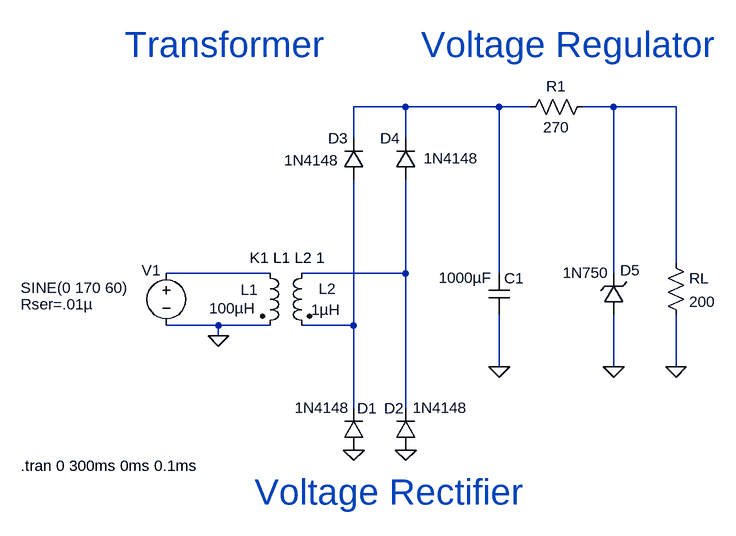
[diagram p0: schematic Midterm02.asc]
Midterm02.asc, the LTspice schematic file:
Version 4
SHEET 1 1308 680
WIRE 384 -96 304 -96
WIRE 528 -96 384 -96
WIRE 576 -96 528 -96
WIRE 704 -96 656 -96
WIRE 800 -96 704 -96
WIRE 304 -48 304 -96
WIRE 384 -48 384 -96
WIRE 800 144 800 -96
WIRE 176 160 16 160
WIRE 384 160 384 16
WIRE 384 160 224 160
WIRE 528 160 528 -96
WIRE 704 160 704 -96
WIRE 96 240 16 240
WIRE 176 240 96 240
WIRE 304 240 304 16
WIRE 304 240 224 240
WIRE 96 256 96 240
WIRE 528 304 528 224
WIRE 704 304 704 224
WIRE 800 304 800 224
WIRE 304 368 304 240
WIRE 384 368 384 160
FLAG 304 432 0
FLAG 384 432 0
FLAG 96 256 0
FLAG 528 304 0
FLAG 704 304 0
FLAG 800 304 0
SYMBOL voltage 16 144 R0
WINDOW 0 -38 11 Left 2
WINDOW 3 -224 38 Left 2
WINDOW 123 0 0 Left 0
WINDOW 39 -224 64 Left 2
SYMATTR InstName V1
SYMATTR Value SINE(0 170 60)
SYMATTR SpiceLine Rser=.01µ
SYMBOL ind2 160 144 R0
WINDOW 0 -30 41 Left 2
WINDOW 3 -78 70 Left 2
SYMATTR InstName L1
SYMATTR Value 100µH
SYMATTR Type ind
SYMBOL ind2 240 144 M0
WINDOW 0 -37 40 Left 2
WINDOW 3 -43 72 Left 2
SYMATTR InstName L2
SYMATTR Value 1µH
SYMATTR Type ind
SYMBOL diode 320 432 R180
WINDOW 3 22 65 Left 2
WINDOW 0 -20 64 Left 2
SYMATTR Value 1N4148
SYMATTR InstName D1
SYMBOL diode 400 432 R180
WINDOW 3 -80 65 Left 2
WINDOW 0 18 64 Left 2
SYMATTR Value 1N4148
SYMATTR InstName D2
SYMBOL diode 320 16 R180
WINDOW 0 24 64 Left 2
WINDOW 3 38 30 Left 2
SYMATTR InstName D3
SYMATTR Value 1N4148
SYMBOL diode 400 16 R180
WINDOW 0 24 64 Left 2
WINDOW 3 -97 33 Left 2
SYMATTR InstName D4
SYMATTR Value 1N4148
SYMBOL cap 512 160 R0
WINDOW 3 -77 7 Left 2
SYMATTR Value 1000µF
SYMATTR InstName C1
SYMBOL res 672 -112 R90
WINDOW 0 0 56 VBottom 2
WINDOW 3 32 56 VTop 2
SYMATTR InstName R1
SYMATTR Value 270
SYMBOL res 784 128 R0
SYMATTR InstName RL
SYMATTR Value 200
SYMBOL zener 720 224 R180
WINDOW 0 -25 69 Left 2
WINDOW 3 23 65 Left 2
SYMATTR InstName D5
SYMATTR Value 1N750
TEXT -208 456 Left 2 !.tran 0 300ms 0ms 0.1ms
TEXT 144 136 Left 2 !K1 L1 L2 1
TEXT -48 -192 Left 5 ;Transformer
TEXT 152 496 Left 5 ;Voltage Rectifier
TEXT 408 -192 Left 5 ;Voltage Regulator

The netlist it stands for:
* Midterm02.asc
V1 N003 0 SINE(0 170 60) Rser=.01µ
L1 N003 0 100µH
L2 N004 N005 1µH
D1 0 N005 1N4148
D2 0 N004 1N4148
D3 N005 N001 1N4148
D4 N004 N001 1N4148
C1 N001 0 1000µF
R1 N002 N001 270
RL N002 0 200
D5 0 N002 1N750
.model D D
.lib standard.dio
.tran 0 300ms 0ms 0.1ms
K1 L1 L2 1
* Transformer
* Voltage Rectifier
* Voltage Regulator
.backanno
.end